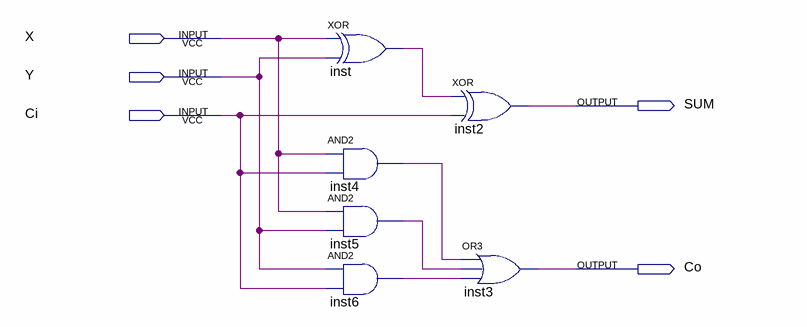
[diagram p0: schematic sheet]
// Quartus schematic full_adder.bdf as structural Verilog: 6 symbols, 5 pins
module full_adder (
  input  X,
  input  Y,
  input  Ci,
  output SUM,
  output Co
);

  wire inst4_out, inst5_out, inst6_out, inst_out;

  xor inst (inst_out, X, Y);
  and inst4 (inst4_out, X, Ci);
  and inst5 (inst5_out, X, Y);
  and inst6 (inst6_out, Y, Ci);
  xor inst2 (SUM, inst_out, Ci);
  or inst3 (Co, inst4_out, inst5_out, inst6_out);
endmodule
